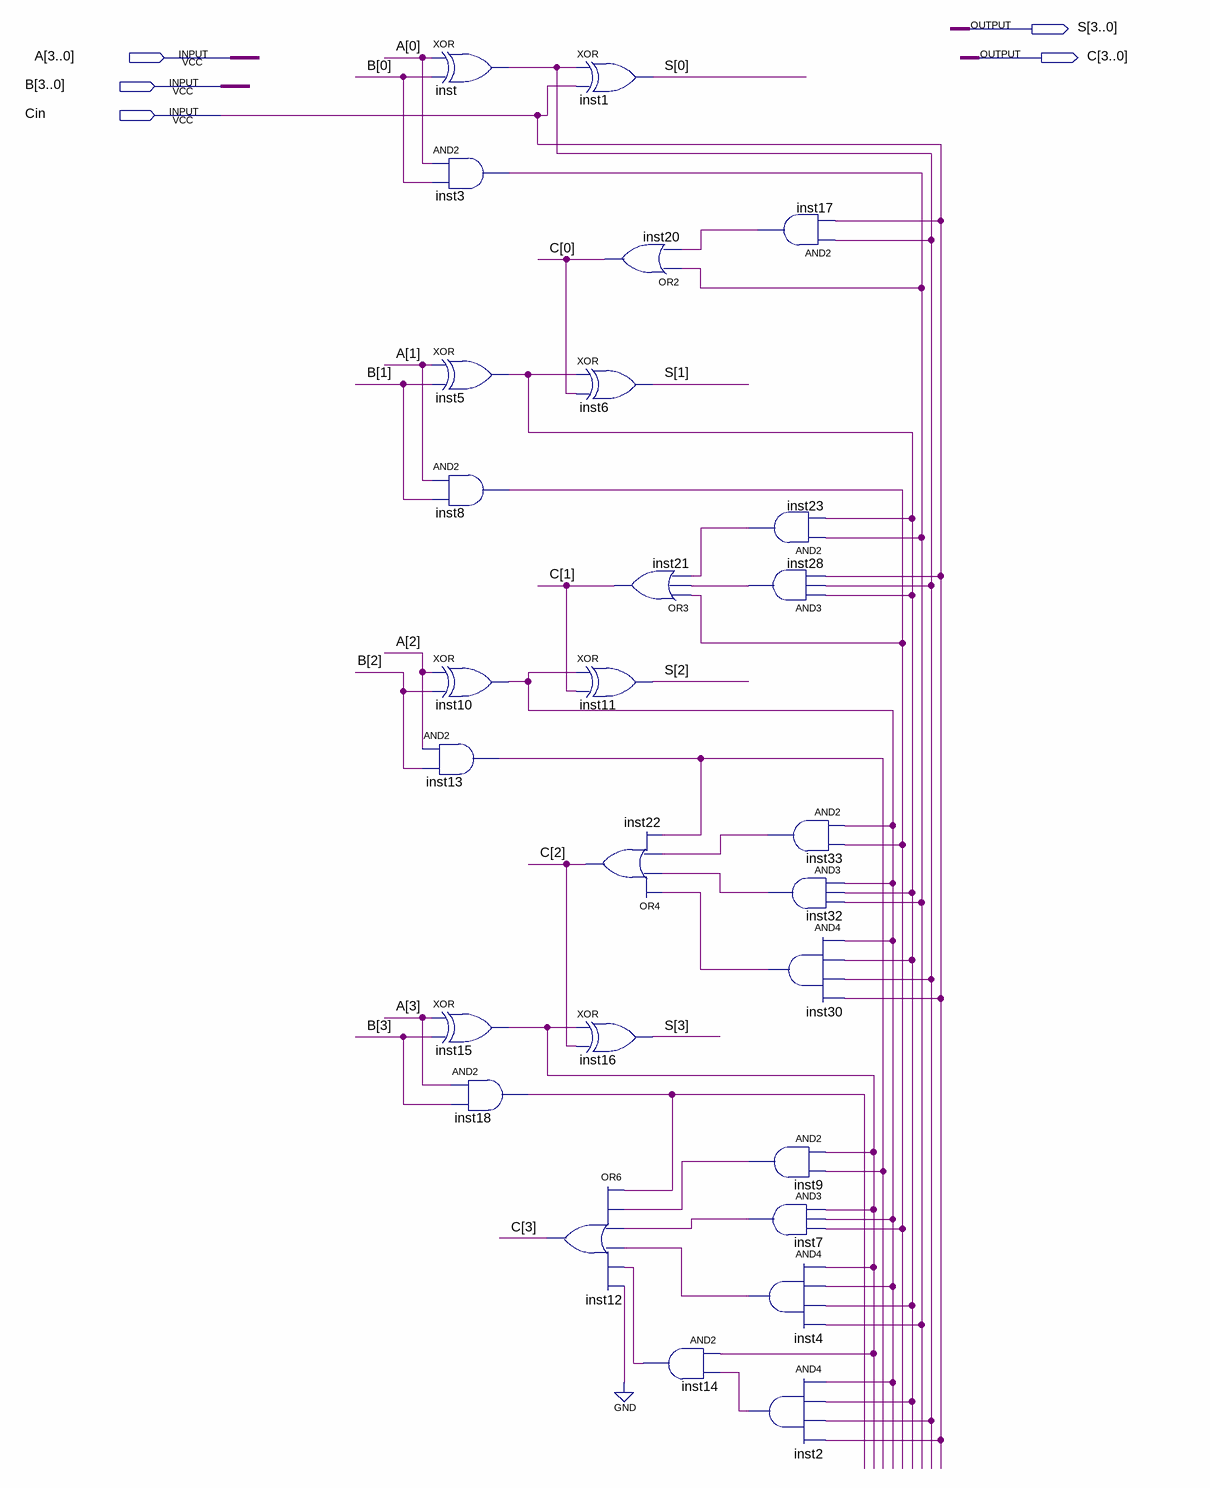
[diagram p0: schematic sheet]
// Quartus schematic CLAAdder.bdf as structural Verilog: 27 symbols, 5 pins
module CLAAdder (
  input  [3:0] A,
  input  [3:0] B,
  input  Cin,
  output [3:0] S,
  output [3:0] C
);

  wire inst2_out, inst3_out, inst4_out, inst5_out, inst7_out, inst8_out, inst9_out, inst10_out, inst13_out,
       inst14_out, inst15_out, inst17_out, inst18_out, inst23_out, inst28_out, inst30_out, inst32_out,
       inst33_out, inst_out;

  xor inst (inst_out, A[0], B[0]);
  and inst3 (inst3_out, A[0], B[0]);
  xor inst5 (inst5_out, A[1], B[1]);
  and inst8 (inst8_out, A[1], B[1]);
  xor inst10 (inst10_out, A[2], B[2]);
  and inst13 (inst13_out, A[2], B[2]);
  xor inst15 (inst15_out, A[3], B[3]);
  and inst18 (inst18_out, A[3], B[3]);
  xor inst1 (S[0], inst_out, Cin);
  or inst20 (C[0], inst3_out, inst17_out);
  xor inst6 (S[1], inst5_out, C[0]);
  xor inst11 (S[2], inst10_out, C[1]);
  or inst22 (C[2], inst30_out, inst32_out, inst33_out, inst13_out);
  xor inst16 (S[3], inst15_out, C[2]);
  or inst12 (C[3], inst18_out, inst9_out, inst7_out, inst4_out, inst14_out, 1'b0);
  or inst21 (C[1], inst8_out, inst28_out, inst23_out);
  and inst14 (inst14_out, inst15_out, inst2_out);
  and inst17 (inst17_out, inst_out, Cin);
  and inst23 (inst23_out, inst3_out, inst5_out);
  and inst28 (inst28_out, inst5_out, inst_out, Cin);
  and inst9 (inst9_out, inst15_out, inst13_out);
  and inst7 (inst7_out, inst15_out, inst10_out, inst8_out);
  and inst4 (inst4_out, inst15_out, inst10_out, inst5_out, inst3_out);
  and inst2 (inst2_out, inst10_out, inst5_out, inst_out, Cin);
  and inst33 (inst33_out, inst10_out, inst8_out);
  and inst32 (inst32_out, inst10_out, inst5_out, inst3_out);
  and inst30 (inst30_out, inst10_out, inst5_out, inst_out, Cin);
endmodule
